# Altium schematic sheet 2022_AESK_UAV_Sensors.SchDoc: =pROJECTnAME
size A4; Organization: AESK; Address1: Designed by:; Address3: FATİH CAN; Revision: 2022 v1; SheetNumber: 2; SheetTotal: 6
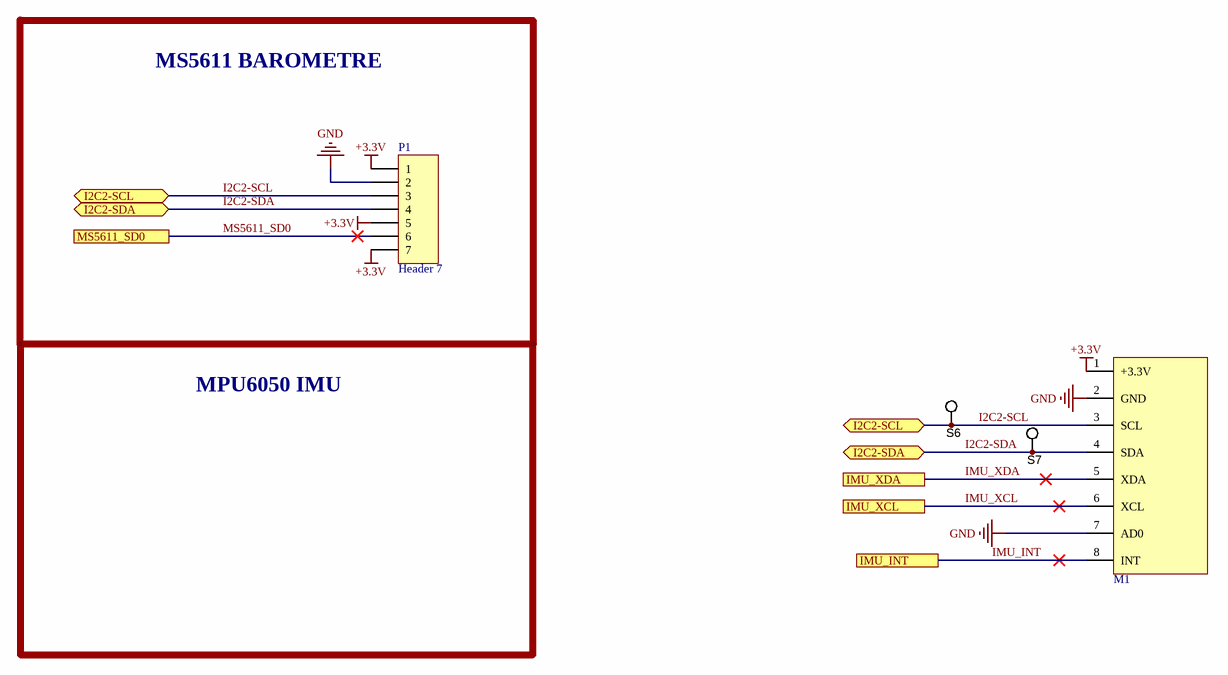
[diagram p0: 2022_AESK_UAV_Sensors.SchDoc]

## Parts
M1  MPU-9255(resim ve supplier bilgileri mpu6050dir)  [MPU-9255(GY-87)]  (value not drawn)
P1  Header 7  [HDR1X7]
S6  5002  [Keystone5002]  (value not drawn)
S7  5002  [Keystone5002]  (value not drawn)

## Ports
I2C2-SCL (bidir), I2C2-SDA (bidir), IMU_INT, IMU_XCL, IMU_XDA, MS5611_SD0

## Nets
+3.3V: M1.1(+3.3V) P1.1 P1.5 P1.7
GND: M1.2(GND) M1.7(AD0) P1.2
I2C2-SCL: M1.3(SCL) P1.3 S6.1 ; port I2C2-SCL
I2C2-SDA: M1.4(SDA) P1.4 S7.1 ; port I2C2-SDA
IMU_INT: M1.8(INT) ; port IMU_INT
IMU_XCL: M1.6(XCL) ; port IMU_XCL
IMU_XDA: M1.5(XDA) ; port IMU_XDA
MS5611_SD0: P1.6 ; port MS5611_SD0

## Notes on the sheet
- MS5611 BAROMETRE
- MPU6050 IMU
- Title
- Size:
- Date:
- A4
- Number:
- Time:
- Revision:
- Sheet
- of
- File:

## Library data of the parts
M1 = MPU-9255(GY-87): Manufacturer 1: TDK InvenSense; Manufacturer Part Number 1: MPU-6050EVB; Sensor Type: Accelerometer,Gyroscope,3 Axis; Interface: I2C; Evaluation Kit: Yes; ComponentLink1Description: MPU-9255(gyroscope/accellemeter/magnometer/barometer); ComponentLink1URL: https://pdf.direnc.net/upload/mpu-9255-datasheet.pdf; category: Sensor; Supplier 1: Digi-Key; Supplier Part Number 1: 1428-1008-ND; Stock 1: 2; Pricing 1: 1=56,00000, 5=50,75000, 10=48,12500, 25=46,55000 (USD); RoHS: Yes; Package Quantity: 1; ComponentLink2URL: https://store.invensense.com/datasheets/invensense/MPU-6000EVB.pdf?src-supplier=Digi-Key; ComponentLink2Description: https://store.invensense.com/datasheets/invensense/MPU-6000EVB.pdf?src-supplier=Digi-Key
P1 = Header 7: Header, 7-Pin; LatestRevisionDate: 17-Jul-2002; LatestRevisionNote: Re-released for DXP Platform.; Publisher: Altium Limited
S6 S7 = 5002: Test Point, TH, Miniature, White; Manufacturer: Keystone; CompType: Test Point Loop; U/M: EA; RoHS: Y; DigiKeyPartNumber: 5002K-ND; Value: White; SymbolVersion: 2008-04-04; PartNumber: 5002; PackageReference: Keystone5002; ComponentLink1Description: Datasheet Link; ComponentLink1URL: http://www.keyelco.com/pdfs/M55p51.pdf; MountType: TH; Publisher: National Semiconductor; LatestRevisionDate: 2011-09-29; LatestRevisionNote: Removed DigiKeyPartNumber parameter.; Alternate Manufacturer: -; Alternate PartNumber: -; Supplier 1: Digi-Key; Supplier Part Number 1: 5002K-ND; Supplier 2: Newark; Supplier Part Number 2: 82H9632